# EAGLE design FTDI_prog (EAGLE 6.4)
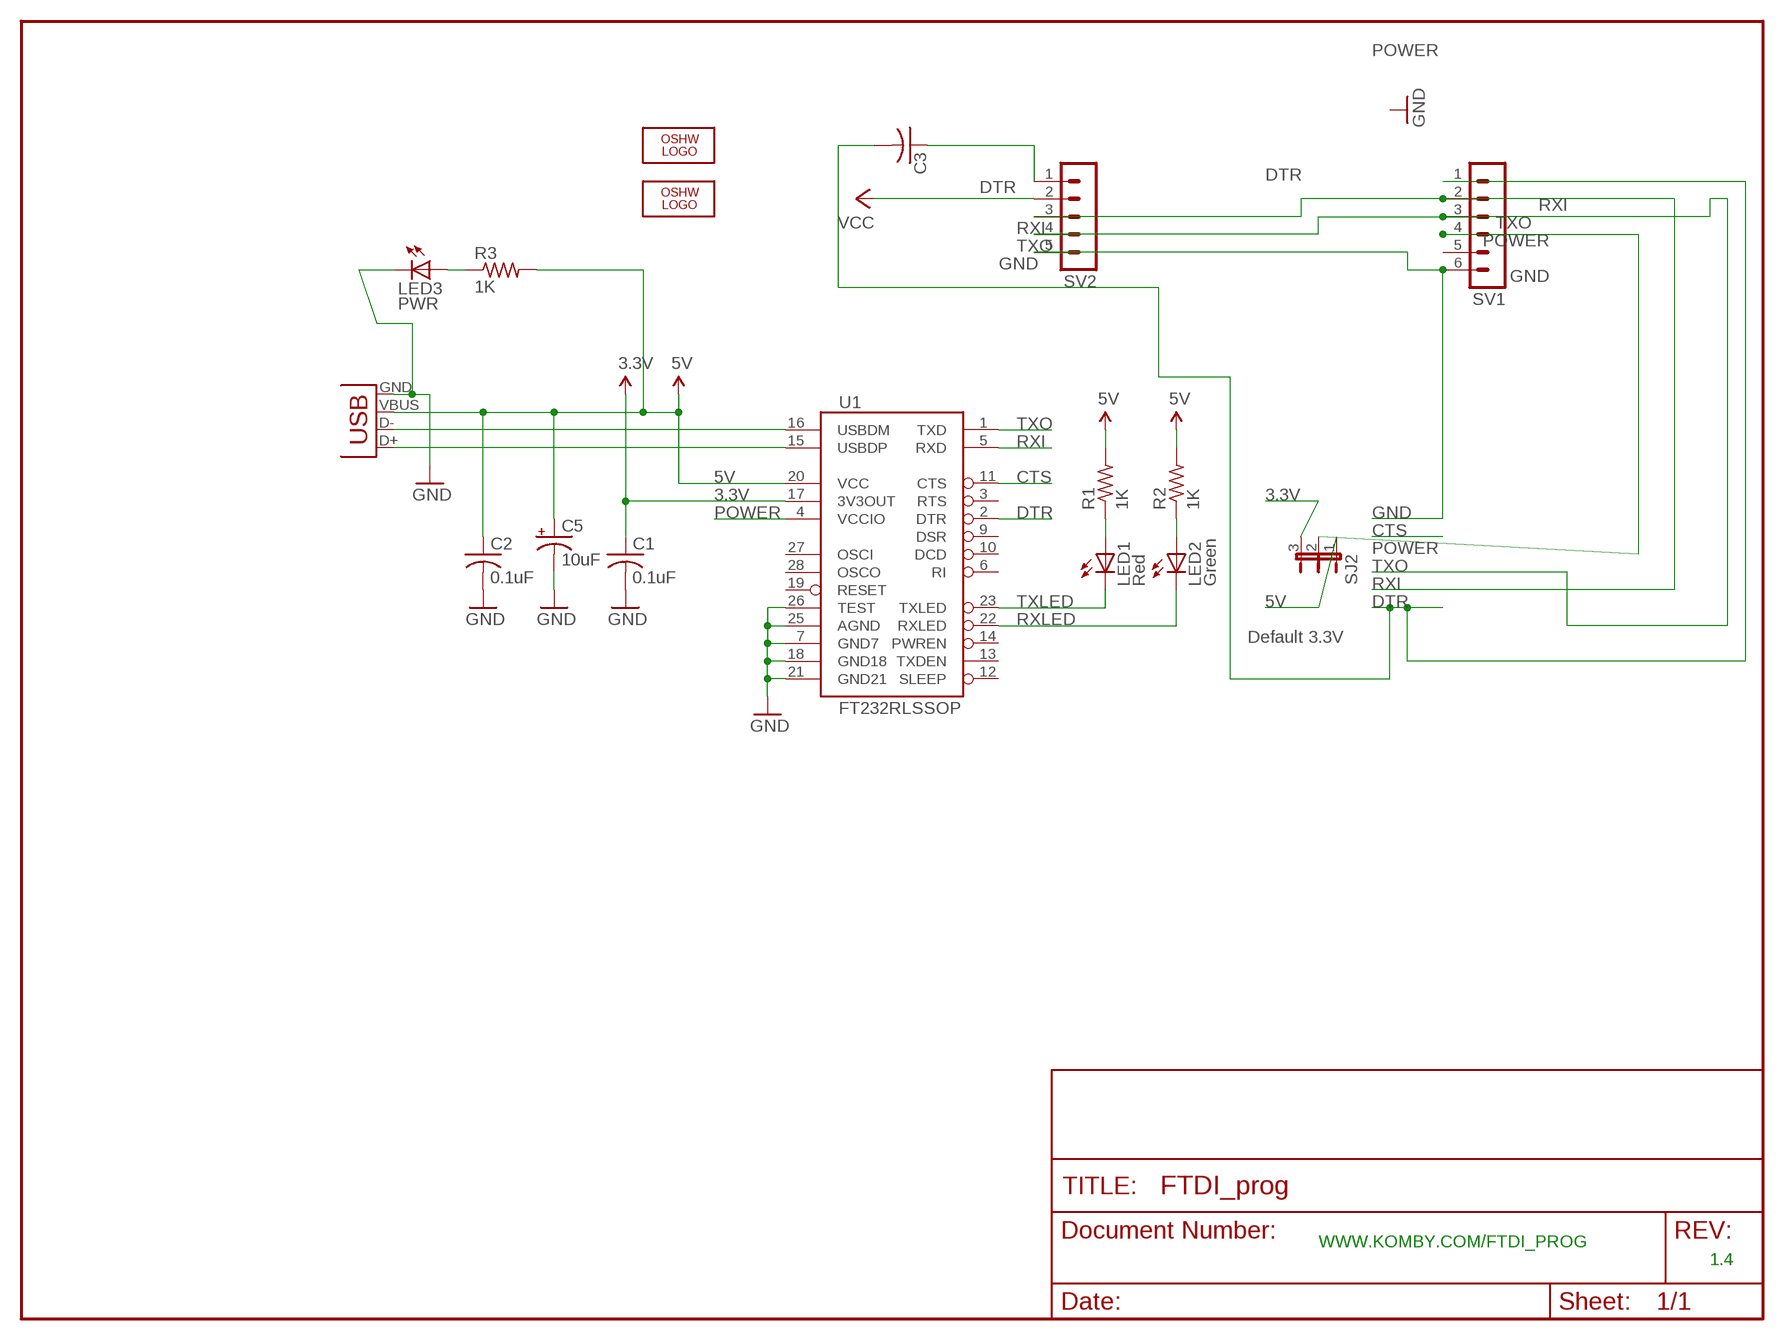
[diagram p0: schematic, sheet 1]

## Parts
C1  0.1uF  C-US025-024X044  [C025-024X044]
C2  0.1uF  C-US025-024X044  [C025-024X044]
C3  C-US025-024X044  [C025-024X044]
C5  10uF  CPOL-USE1.8-4  [E1,8-4]
LED1  Red  LED3MM  [LED3MM]
LED2  Green  LED3MM  [LED3MM]
LED3  PWR  LED3MM  [LED3MM]
LOGO1  OSHW_LOGO_6MILX0070-NT  [OSHW_6X70_NOTEXT]
LOGO2  OSHW_LOGO_6MILX0070-NT  [OSHW_6X70_NOTEXT]
R1  1K  R-US_0207/7  [0207/7]
R2  1K  R-US_0207/7  [0207/7]
R3  1K  R-US_0207/7  [0207/7]
SJ2  JP2E  [JP2]
SV1  MA06-1  [MA06-1]
SV2  MA05-1  [MA05-1]
U1  FT232RLSSOP  [SSOP28DB]
X2  USB-SMD-NS  [USB-MINIB-NOSTOP]

## Nets
3.3V [vcc]: C1.1 SJ2.3 U1.17(3V3OUT)
5V: C2.1 C5.+ R1.2 R2.2 R3.2 SJ2.1 U1.20(VCC) X2.VBUS
CTS: U1.11(CTS)
DTR: C3.2 SV1.1 U1.2(DTR)
GND [vcc]: C1.2 C2.2 C5.- LED3.K(C) SV1.6 SV2.5 U1.7(GND7) U1.18(GND18) U1.21(GND21) U1.25(AGND) U1.26(TEST) X2.GND
N$1: LED1.A R1.1
N$2: LED2.A R2.1
N$3: LED3.A R3.1
N$4: C3.1 SV2.1
POWER [vcc]: SJ2.2 SV1.4 SV2.2 U1.4(VCCIO) ; supply symbol labelled VCC
RXI: SV1.2 SV2.3 U1.5(RXD)
RXLED: LED2.K(C) U1.22(RXLED)
TXLED: LED1.K(C) U1.23(TXLED)
TXO: SV1.3 SV2.4 U1.1(TXD)
USB_D+: U1.15(USBDP) X2.D+
USB_D-: U1.16(USBDM) X2.D-
Unconnected: SV1.5 U1.3(RTS) U1.6(RI) U1.9(DSR) U1.10(DCD) U1.12(SLEEP) U1.13(TXDEN) U1.14(PWREN) U1.19(RESET) U1.27(OSCI) U1.28(OSCO)

## Notes on the sheet
- Default 3.3V
- WWW.KOMBY.COM/FTDI_PROG
- 1.4

## Library data of the parts
C1-C3 = adafruit:C-US: CAPACITOR, American symbol
C5 = adafruit:CPOL-US: POLARIZED CAPACITOR, American symbol
LED1-LED3 = adafruit:LED: LED OSRAM: - CHIPLED LG R971, LG N971, LY N971, LG Q971, LY Q971, LO R971, LY R971 LH N974, LH R974 LS Q976, LO Q976, LY Q976 LO Q996 - Hyper CHIPLED LW Q18S LB Q993, LB Q99A, LB R99A - SideLED LS A670, LO A670, LY A670, LG A670, LP A670 LB A673, LV A673, LT A673, LW A673 LH A674 LY A675 LS A676, LA A676, LO A676, LY A676, LW A676 LS A679, LY A679, LG A679 - Hyper Micro SIDELED® LS Y876, LA Y876, LO Y876, LY Y876 LT Y87S - SmartLED LW L88C, LW L88S LB L89C, LB L89S, LG L890 LS L89K, LO L89K, LY L89K LS L896, LA L896, LO L896, LY L896 - TOPLED LS T670, LO T670, LY T670, LG T670, LP T670 LSG T670, LSP T670, LSY T670, LOP T670, LYG T670 LG T671, LOG T671, LSG T671 LB T673, LV T673, LT T673, LW T673 LH T674 LS T676, LA T676, LO T676, LY T676, LB T676, LH T676, LSB T676, LW T676 LB T67C, LV T67C, LT T67C, LS T67K, LO T67K, LY T67K, LW E67C LS E67B, LA E67B, LO E67B, LY E67B, LB E67C, LV E67C, LT E67C LW T67C LS T679, LY T679, LG T679 LS T770, LO T770, LY T770, LG T770, LP T770 LB T773, LV T773, LT T773, LW T773 LH T774 LS E675, LA E675, LY E675, LS T675 LS T776, LA T776, LO T776, LY T776, LB T776 LHGB T686 LT T68C, LB T68C - Hyper Mini TOPLED® LB M676 - Mini TOPLED Santana® LG M470 LS M47K, LO M47K, LY M47K Source: http://www.osram.convergy.de/
LOGO1 LOGO2 = ohw-logo:OSHW_LOGO_6MIL
R1-R3 = adafruit:R-US_: RESISTOR, American symbol
SJ2 = jumper:JP2E: JUMPER
SV1 = con-lstb:MA06-1: PIN HEADER; OC_FARNELL: unknown; OC_NEWARK: unknown
SV2 = con-lstb:MA05-1: PIN HEADER; OC_FARNELL: unknown; OC_NEWARK: unknown
U1 = SparkFun:FT232RL: USB UART FT232RL 4th Generation USB UART (USB <-> Serial) Controller. Spark Fun Electronics SKU : COM-00650
X2 = SparkFun:USB: USB Connectors USB-B-PTH is fully proven SKU : PRT-00139 USB-miniB is fully proven SKU : PRT-00587 USB-A-PCB is untested. USB-A-H is throughly reviewed, but untested. Spark Fun Electronics SKU : PRT-00437 USB-B-SMT is throughly reviewed, but untested. Needs silkscreen touching up. USB-A-S has not been used/tested USB-MB-H has not been used/tested

## Net classes
0 default: width 0.254 mm
1 vcc: width 0.305 mm

## Board
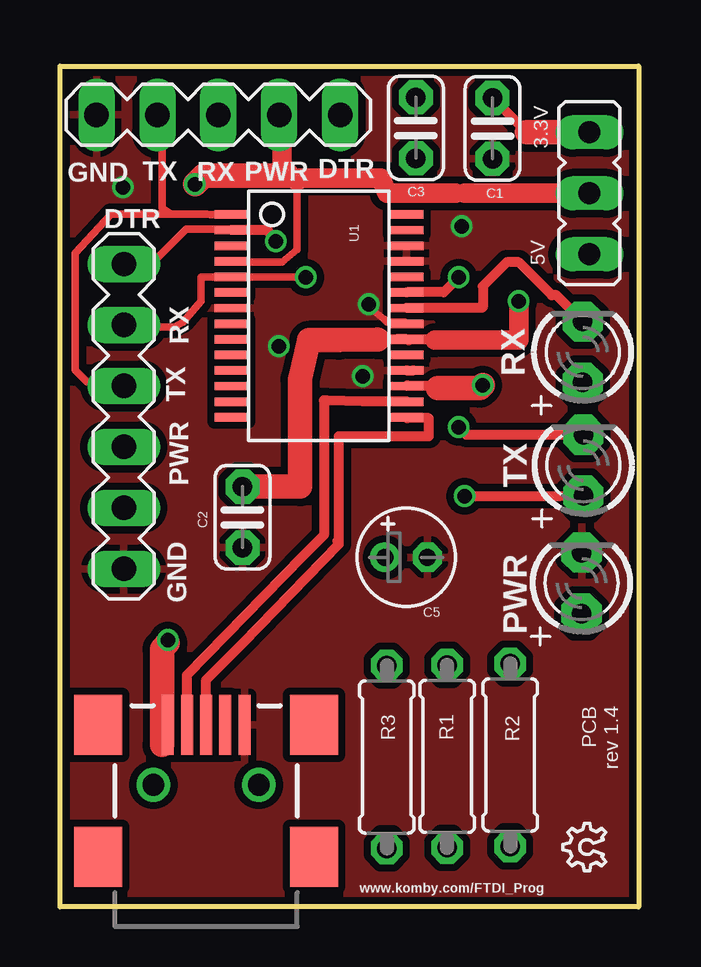
[diagram p1: board, top side]
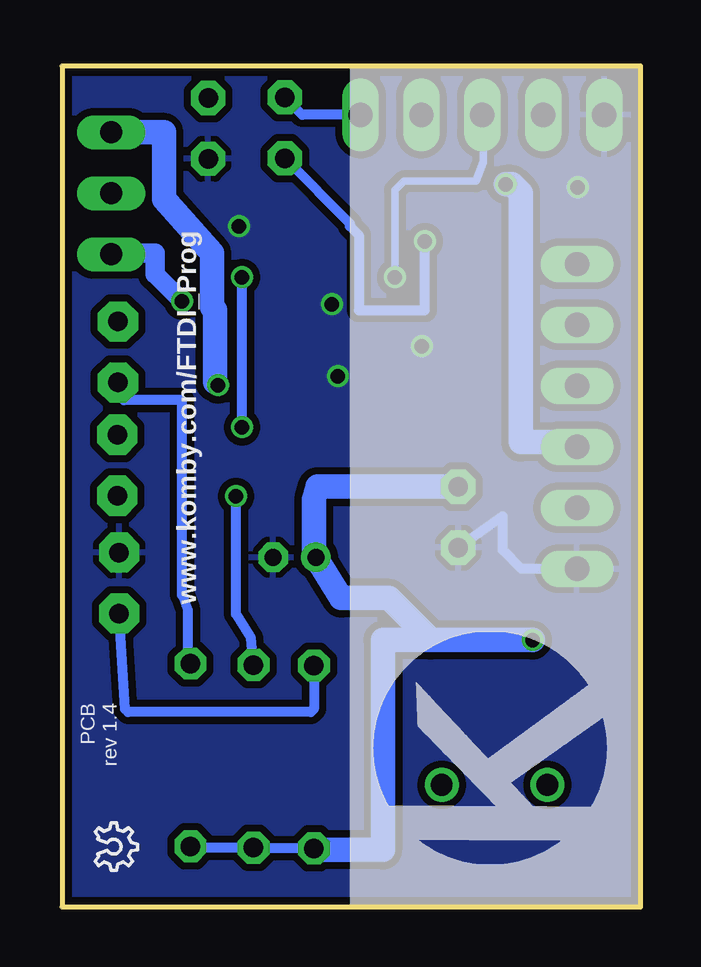
[diagram p2: board, bottom side, seen from below]

Size 24.13 x 35.05 mm. Coordinates in mm from the lower left corner, seen from the top.
Outline: 24.13,35.05 24.13,0 0,0 0,35.05 24.13,35.05
Copper layers (1*16): Top 0.035mm / dielectric 1.5mm / Bottom 0.035mm
Design rules "Fusion_eagle_rule_v1.1": minimum track width 6mil, minimum drill 12mil, track to track 6mil, track to pad 6mil, pad to pad 6mil, via to via 6mil, smd to smd 0mil, copper to edge 10mil, drill to drill 10mil, minimum pad ring 10mil, minimum via ring 6mil, stop-mask expansion 2mil, vias tented up to drill 100mil, thermal gap 10mil

### Footprints (pad centres in the part's own frame; a part is rotated, then mirrored left to right if it is on the bottom)
C025-024X044 = drill 0.813 pad 1.422 octagon: 1 -1.27,0; 2 1.27,0
E1,8-4 = drill 0.711 pad 1.168: + -0.889,0 | drill 0.711 pad 1.168 octagon: - 0.889,0
LED3MM = drill 0.813 pad 1.676 octagon: A -1.27,0; K 1.27,0
0207/7 = drill 0.813 octagon: 1 -3.81,0; 2 3.81,0
JP2 = drill 0.914 long: 1 -2.54,0; 2 0,0; 3 2.54,0
MA06-1 = drill 1.016 long: 1 -6.35,0; 2 -3.81,0; 3 -1.27,0; 4 1.27,0; 5 3.81,0; 6 6.35,0
MA05-1 = drill 1.016 long: 1 -5.08,0; 2 -2.54,0; 3 0,0; 4 2.54,0; 5 5.08,0
SSOP28DB = smd 0.348 x 1.397: 1 -4.225,-3.656; 2 -3.575,-3.656; 3 -2.925,-3.656; 4 -2.275,-3.656; 5 -1.625,-3.656; 6 -0.975,-3.656; 7 -0.325,-3.656; 8 0.325,-3.656; 9 0.975,-3.656; 10 1.625,-3.656; 11 2.275,-3.656; 12 2.925,-3.656; 13 3.575,-3.656; 14 4.225,-3.656; 15 4.225,3.656; 16 3.575,3.656; 17 2.925,3.656; 18 2.275,3.656; 19 1.625,3.656; 20 0.975,3.656; 21 0.325,3.656; 22 -0.325,3.656; 23 -0.975,3.656; 24 -1.625,3.656; 25 -2.275,3.656; 26 -2.925,3.656; 27 -3.575,3.656; 28 -4.225,3.656
USB-MINIB-NOSTOP = smd 2.5 x 0.5: D+ 2.5,0; D- 2.5,0.8; GND 2.5,-1.6; ID 2.5,-0.8; VBUS 2.5,1.6 | smd 2.5 x 2: G1 -3,-4.5; G2 -3,4.5; G3 2.5,4.5; G4 2.5,-4.5 | drill 0.9 pad 0.8: H1 0,2.2 | drill 0.9 pad 0.787: H2 0,-2.2

### Placement (x,y rotation side)
C1  18.04,32.45 270 top
C2  7.61,16.25 270 top
C3  14.84,32.48 270 top
C5  14.44,14.57 0 top
LED1  21.83,18.41 90 top
LED2  21.8,23.13 90 top
LED3  21.75,13.5 90 top
LOGO1  22.75,1.5 90 top
LOGO2  22.75,3.5 270 bottom
R1  16.14,6.28 270 top
R2  18.77,6.33 270 top
R3  13.62,6.25 270 top
SJ2  22.08,29.75 90 top
SV1  2.66,20.45 270 top
SV2  6.6,33.02 180 top
U1  10.79,24.64 270 top
U$2  [KOMBY_LOGO_1CMX1CM]  1.38,1.75 90 bottom
X2  6.09,5.09 90 top

### Tracks (layer width: path | path; a pad name or v marks a point on that pad's centre or on a via)
3.3V  (via drill 0.6)
  Top 0.406: C1.1 19.47,32.29 | 14.49,21.75 U1.17 15.66,21.71 15.75,21.62
  Top 1.016: 19.47,32.29 SJ2.3 | v17.62,21.75 17.5,21.62 15.75,21.62
  Bottom 0.406: v17.62,21.75 17.75,21.88 | 17.75,24.88 17.88,25
  Bottom 1.016: 17.75,21.88 17.75,24.88 | 17.88,25 17.88,27.25 19.88,29.5 19.88,32.29 SJ2.3
5V  (via drill 0.6)
  Top 0.406: 4.49,10.99 v4.5,11.12 | 14.54,23.62 U1.20 14.04,23.66 13.24,23.65 15.85,23.65 15.62,23.62 | X2.VBUS 4.25,7.34 4.25,6.75
  Top 0.813: v19.12,25.25 19.12,23.62 15.62,23.62
  Top 1.016: 13.24,23.65 11.62,23.62 10.38,23.62 10,22 10.02,17.52 C2.1 | 4.49,10.99 4.25,10.75 4.25,6.75
  Bottom 0.406: 13.75,2.38 R3.2 16.02,2.44 R1.2 18.77,2.47 R2.2 | C5.+ 13.62,14.65
  Bottom 0.813: SJ2.1 22.04,27.25 20.25,27.25 20.25,26.38 v19.12,25.25
  Bottom 1.016: v4.5,11.12 8.75,11.12 | 8.75,11.12 10.5,12.88 12.49,12.88 C5.+ | 8.75,11.12 10.75,11.12 10.75,2.38 13.75,2.38 | 13.62,14.65 13.62,17 13.48,17.52 C2.1
DTR  (via drill 0.6)
  Top 0.305: SV1.1 3.8,26.8 5.25,28.25 7.1,28.25 U1.2
  Top 0.406: v9,27.75 8.66,28.21 U1.2
  Bottom 0.406: C3.2 12.12,28.49 12.12,28.38 11.75,28 11.75,24.88 9,24.88 v9,27.75
GND  (via drill 0.6)
  Top 0.305: U1.21 14.39,24.38 13.62,24.38 13.5,24.5 12.88,25
  Top 0.406: U1.18 14.74,22.36 | 12.88,24.88 12.88,25 v12.88,25.12
  Bottom 0.406: SV1.6 4.97,14.1 5.75,14.88 5.75,16.29 C2.2
  other vias: 2.62,30 9.12,23.38 12.62,22.12 16.75,28.38
  pour Bottom (isolate 0.305): 0,-0.03 0,35.08 24.13,35.08 24.13,-0.03
  pour Top (isolate 0.305): 0,-0.03 0,35.08 24.13,35.08 24.13,-0.03
N$1  (via drill 0.6)
  Top 0.406: v16.88,17.12 20.83,17.12 LED1.A
  Bottom 0.406: R1.1 16.25,11.21 16.88,12.21 v16.88,17.12
N$2
  Bottom 0.406: R2.1 18.75,10.25 18.88,10.38 18.88,12.38 19.11,13.02 19.12,13.02 | 19.12,13 19.12,13.02 | 19.12,13.02 19.12,21.12 21.55,21.12 LED2.A
N$3
  Bottom 0.406: R3.1 13.62,8.25 13.75,8.12 21.38,8.12 21.5,8.25 LED3.A
N$4
  Bottom 0.406: SV2.1 14.11,33.02 C3.1
POWER  (via drill 0.6)
  Top 0.305: SV2.2 9.25,33.02 | 9.88,30.25 9.89,27.39 9.25,26.88 7.18,26.88 U1.4
  Top 0.406: 16.5,29.75 16.87,29.75 | 9.25,30.62 9.39,30.48 9.49,30.48
  Top 0.813: 9.25,33.02 9.25,30.62 9.88,30.25 10,30.38 13.38,30.38 13.62,29.75 16.5,29.75 | 16.87,29.75 SJ2.2
  Top 1.016: v5.62,30.12 5.98,30.48 9.49,30.48
  Bottom 1.016: SV1.4 2.86,19.38 5,19.38 5,29.75 5.38,30.12 v5.62,30.12
RXI  (via drill 0.6)
  Top 0.305: v10.25,26.25 7.15,26.25 U1.5 5.88,26.26 5.88,25.25 5.12,24.38 4.75,24.18 2.74,24.18 SV1.2
  Bottom 0.305: v10.25,26.25 10.25,29.88 9.88,30.25 6.88,30.25 6.56,31.06 6.56,32.98 SV2.3
RXLED
  Top 0.406: LED2.K 20.7,25.5 20.5,25.5 19.12,26.88 18.62,26.88 17.62,25.88 17.62,25 17.59,24.96 U1.22
TXLED  (via drill 0.6)
  Top 0.406: LED1.K 16.95,19.68 v16.62,20 | v16.62,26.25 16,25.62 14.46,25.62 U1.23
  Bottom 0.406: v16.62,20 v16.62,26.25
TXO
  Top 0.305: U1.1 6.26,28.86 6.12,28.88 4.62,28.88 | 4.62,28.88 4.25,29.12 4.25,32.83 SV2.4 | 4.62,28.88 2.12,28.88 0.62,27.25 0.62,22.38 1.12,21.88 2.5,21.88 SV1.3
USB_D+
  Top 0.305: 11.5,15.25 11.62,15.12 | 14.49,20.38 U1.15
  Top 0.406: X2.D+ 6.09,9.47 7.62,11 11.62,15.12 11.62,19.62 15.38,19.62 15.38,20.38 14.49,20.38
USB_D-
  Top 0.305: 14.43,21.08 U1.16 | 11.12,21.12 11,21.12
  Top 0.406: X2.D- 5.29,9.67 10.12,14.62 11,15.5 11,21.12 | 11.12,21.12 12.62,21.08 14.43,21.08

### Text on the board
tPlace: 3.3V | GND | TX | RX | PWR | DTR | DTR | 5V | RX | RX | TX | PWR | TX | GND | PWR | www.komby.com/FTDI_Prog
bPlace: www.komby.com/FTDI_Prog
tNames: PCB / rev 1.4
bNames: PCB / rev 1.4